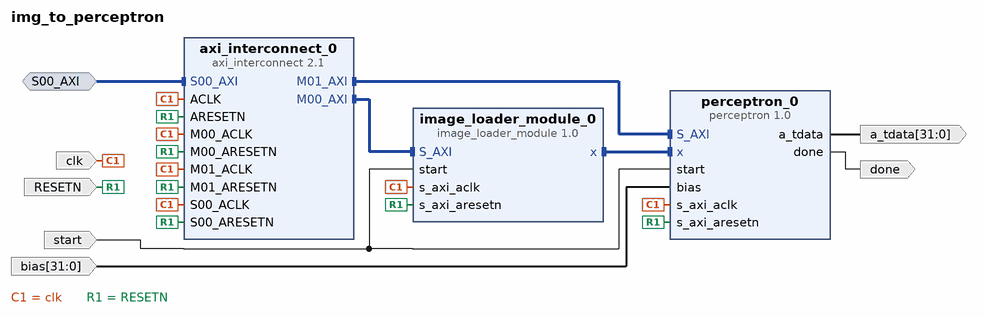
[diagram p0: block diagram of the top level]
# Vivado block design img_to_perceptron, xc7z010clg400-1, Vivado 2019.2
create_bd_design img_to_perceptron

create_bd_intf_port -mode Slave -vlnv xilinx.com:interface:aximm_rtl:1.0 S00_AXI
set_property -dict [list \
  CONFIG.DATA_WIDTH 32 \
  CONFIG.PROTOCOL AXI4 \
  CONFIG.ID_WIDTH 0 \
  CONFIG.ADDR_WIDTH 32 \
  CONFIG.AWUSER_WIDTH 0 \
  CONFIG.ARUSER_WIDTH 0 \
  CONFIG.WUSER_WIDTH 0 \
  CONFIG.RUSER_WIDTH 0 \
  CONFIG.BUSER_WIDTH 0 \
  CONFIG.READ_WRITE_MODE READ_WRITE \
  CONFIG.HAS_BURST 1 \
  CONFIG.HAS_LOCK 1 \
  CONFIG.HAS_PROT 1 \
  CONFIG.HAS_CACHE 1 \
  CONFIG.HAS_QOS 1 \
  CONFIG.HAS_REGION 0 \
  CONFIG.HAS_WSTRB 1 \
  CONFIG.HAS_BRESP 1 \
  CONFIG.HAS_RRESP 1 \
  CONFIG.SUPPORTS_NARROW_BURST 1 \
  CONFIG.NUM_READ_OUTSTANDING 2 \
  CONFIG.NUM_WRITE_OUTSTANDING 2 \
  CONFIG.MAX_BURST_LENGTH 256 \
  CONFIG.NUM_READ_THREADS 1 \
  CONFIG.NUM_WRITE_THREADS 1 \
  CONFIG.RUSER_BITS_PER_BYTE 0 \
  CONFIG.WUSER_BITS_PER_BYTE 0 \
] [get_bd_intf_ports S00_AXI]
create_bd_port -dir O done
create_bd_port -dir O -from 31 -to 0 a_tdata
create_bd_port -dir I -type clk clk
set_property -dict {CONFIG.FREQ_HZ 100000000} [get_bd_ports clk]
create_bd_port -dir I -from 31 -to 0 bias
create_bd_port -dir I -type rst RESETN
set_property -dict {CONFIG.POLARITY ACTIVE_LOW} [get_bd_ports RESETN]
create_bd_port -dir I start

create_bd_cell -type ip -vlnv xilinx.com:ip:axi_interconnect:2.1 axi_interconnect_0
create_bd_cell -type ip -vlnv xilinx.com:user:image_loader_module:1.0 image_loader_module_0
set_property -dict {CONFIG.addressWidth 32} [get_bd_cells image_loader_module_0]
create_bd_cell -type ip -vlnv xilinx.com:user:perceptron:1.0 perceptron_0

# ---- connections ----

connect_bd_intf_net [get_bd_intf_pins axi_interconnect_0/M01_AXI] [get_bd_intf_pins perceptron_0/S_AXI]
connect_bd_intf_net [get_bd_intf_ports S00_AXI] [get_bd_intf_pins axi_interconnect_0/S00_AXI]
connect_bd_intf_net [get_bd_intf_pins axi_interconnect_0/M00_AXI] [get_bd_intf_pins image_loader_module_0/S_AXI]
connect_bd_intf_net [get_bd_intf_pins image_loader_module_0/x] [get_bd_intf_pins perceptron_0/x]
connect_bd_net [get_bd_pins perceptron_0/done] [get_bd_ports done]
connect_bd_net [get_bd_pins perceptron_0/a_tdata] [get_bd_ports a_tdata]
connect_bd_net -net S00_ACLK_1 [get_bd_ports clk] \
  [get_bd_pins axi_interconnect_0/S00_ACLK] [get_bd_pins axi_interconnect_0/M01_ACLK] \
  [get_bd_pins axi_interconnect_0/M00_ACLK] [get_bd_pins axi_interconnect_0/ACLK] \
  [get_bd_pins image_loader_module_0/s_axi_aclk] [get_bd_pins perceptron_0/s_axi_aclk]
connect_bd_net [get_bd_ports bias] [get_bd_pins perceptron_0/bias]
connect_bd_net -net M01_ARESETN_1 [get_bd_ports RESETN] \
  [get_bd_pins axi_interconnect_0/M01_ARESETN] [get_bd_pins axi_interconnect_0/S00_ARESETN] \
  [get_bd_pins axi_interconnect_0/M00_ARESETN] [get_bd_pins axi_interconnect_0/ARESETN] \
  [get_bd_pins image_loader_module_0/s_axi_aresetn] [get_bd_pins perceptron_0/s_axi_aresetn]
connect_bd_net [get_bd_ports start] [get_bd_pins image_loader_module_0/start] [get_bd_pins perceptron_0/start]

# ---- address map ----
assign_bd_address -offset 0x00000000 -range 1G -target_address_space [get_bd_addr_spaces S00_AXI] [get_bd_addr_segs image_loader_module_0/S_AXI/reg0]
assign_bd_address -offset 0x40000000 -range 1G -target_address_space [get_bd_addr_spaces S00_AXI] [get_bd_addr_segs perceptron_0/S_AXI/reg0]

validate_bd_design
save_bd_design
